# EAGLE design tlacitka (EAGLE 5.10)
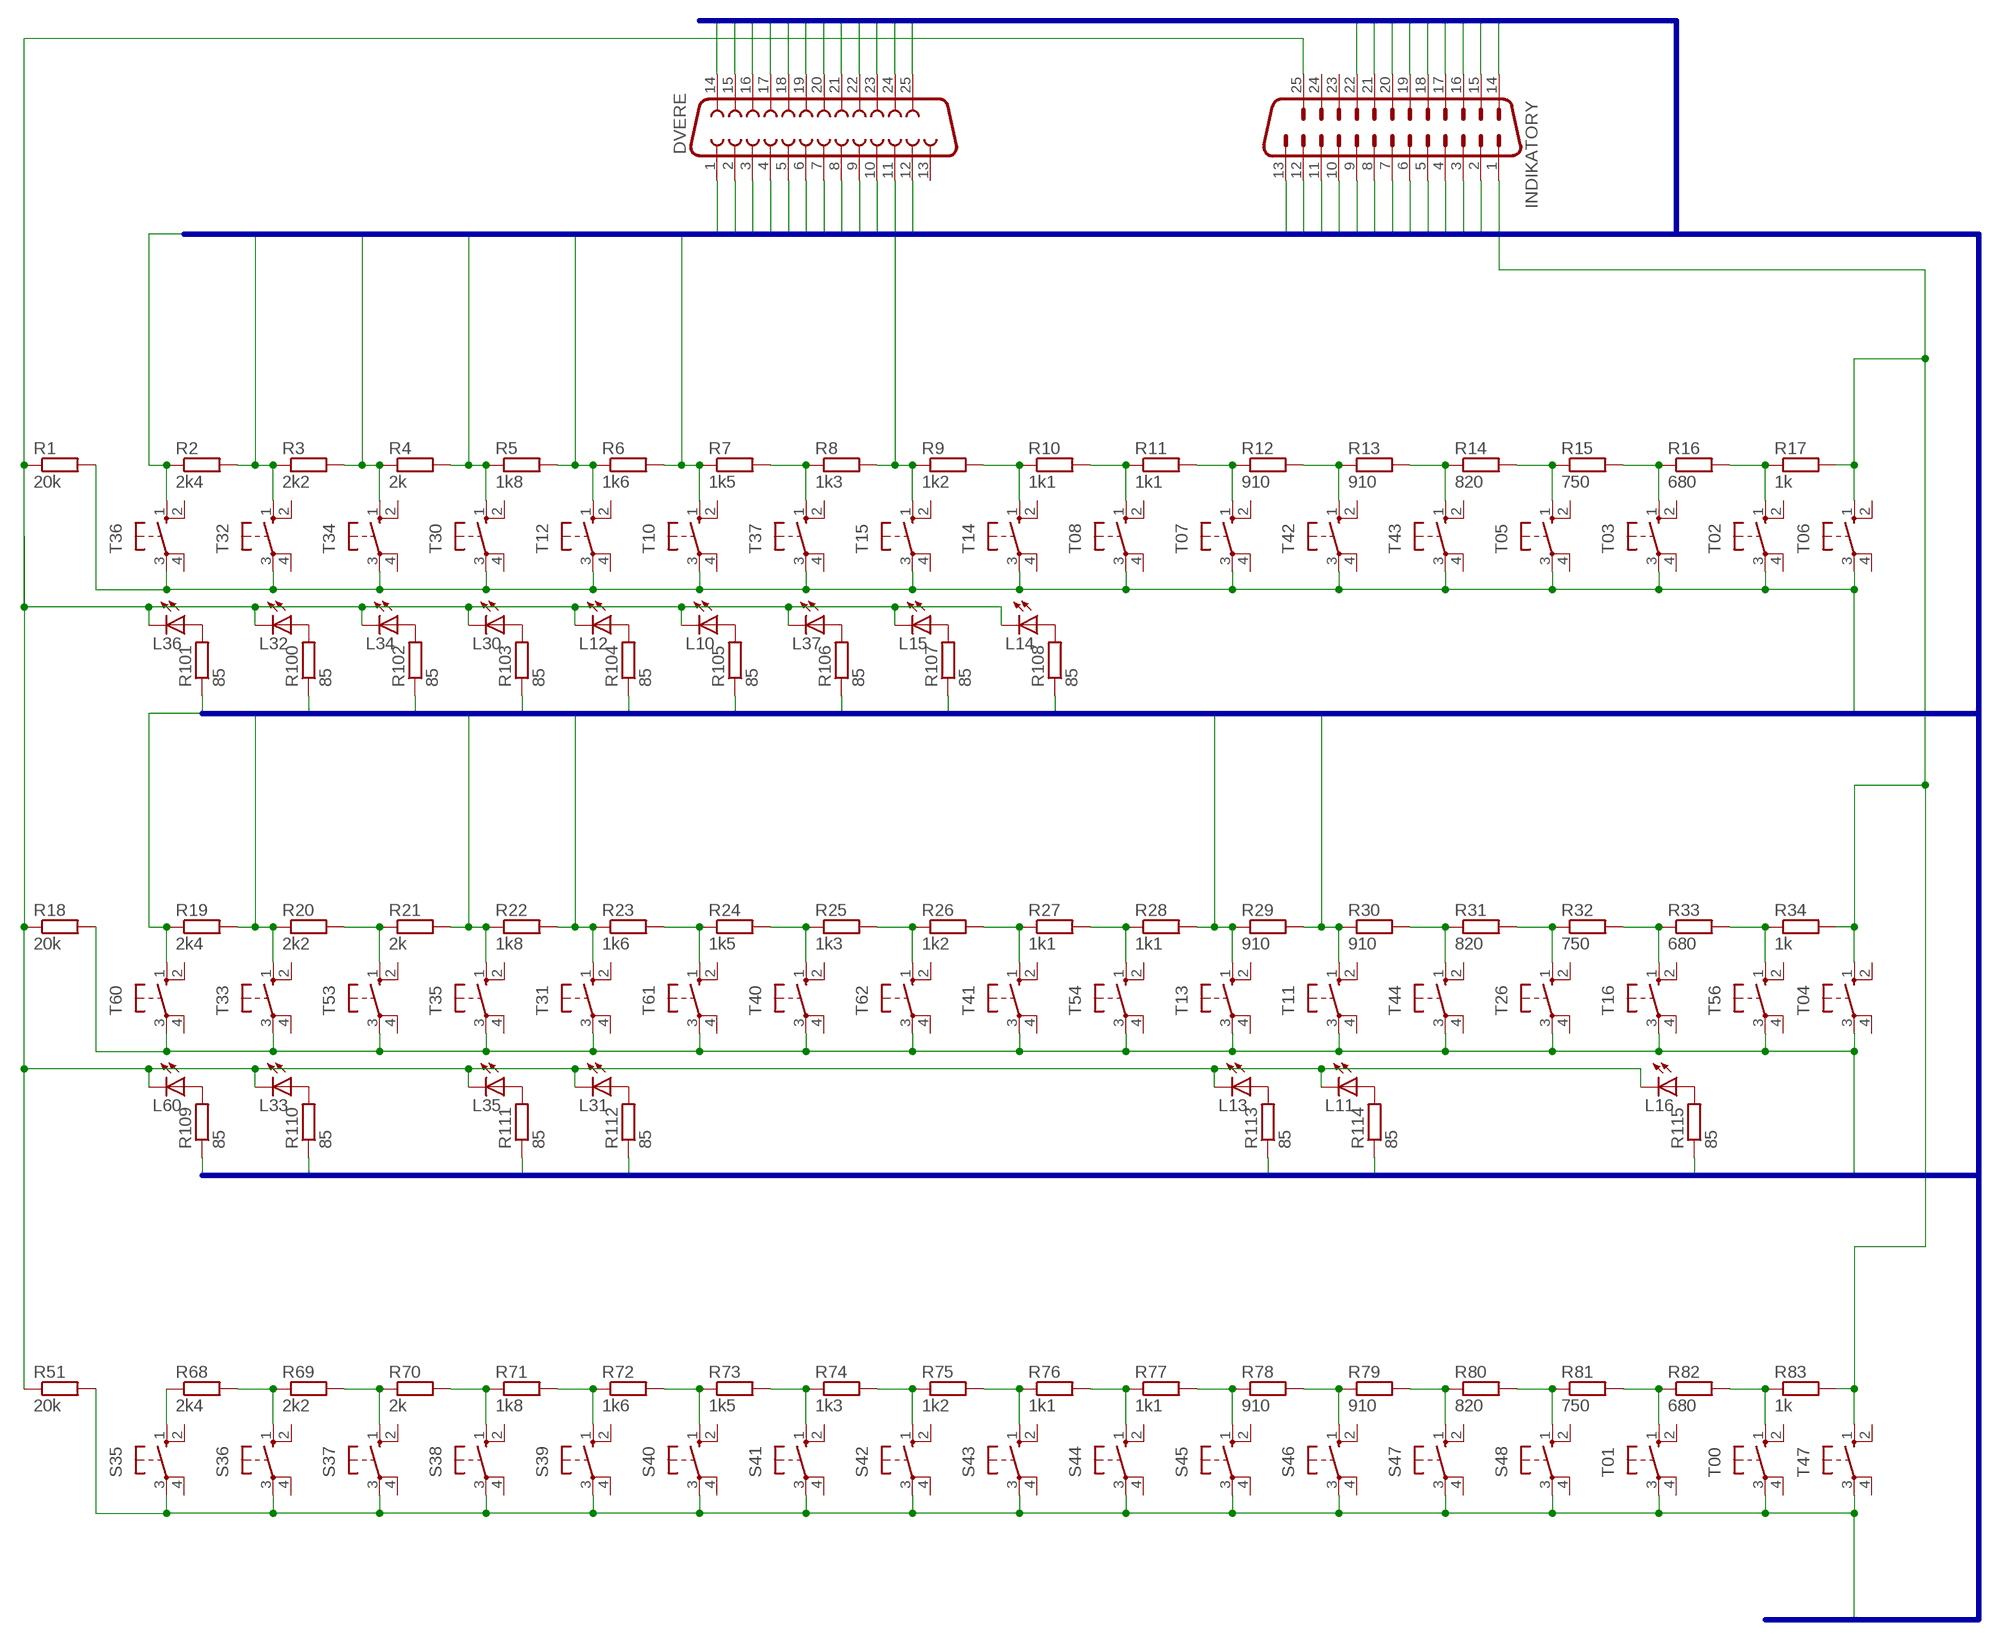
[diagram p0: schematic, sheet 1]

## Parts
DVERE  F25HP  [F25HP]
INDIKATORY  M25HP  [M25HP]
L10  LEDSMT1206  [1206]
L11  LEDSMT1206  [1206]
L12  LEDSMT1206  [1206]
L13  LEDSMT1206  [1206]
L14  LEDSMT1206  [1206]
L15  LEDSMT1206  [1206]
L16  LEDSMT1206  [1206]
L30  LEDSMT1206  [1206]
L31  LEDSMT1206  [1206]
L32  LEDSMT1206  [1206]
L33  LEDSMT1206  [1206]
L34  LEDSMT1206  [1206]
L35  LEDSMT1206  [1206]
L36  LEDSMT1206  [1206]
L37  LEDSMT1206  [1206]
L60  LEDSMT1206  [1206]
R1  20k  R-EU_0204/7  [0204/7]
R2  2k4  R-EU_0204/7  [0204/7]
R3  2k2  R-EU_0204/7  [0204/7]
R4  2k  R-EU_0204/7  [0204/7]
R5  1k8  R-EU_0204/7  [0204/7]
R6  1k6  R-EU_0204/7  [0204/7]
R7  1k5  R-EU_0204/7  [0204/7]
R8  1k3  R-EU_0204/7  [0204/7]
R9  1k2  R-EU_0204/7  [0204/7]
R10  1k1  R-EU_0204/7  [0204/7]
R11  1k1  R-EU_0204/7  [0204/7]
R12  910  R-EU_0204/7  [0204/7]
R13  910  R-EU_0204/7  [0204/7]
R14  820  R-EU_0204/7  [0204/7]
R15  750  R-EU_0204/7  [0204/7]
R16  680  R-EU_0204/7  [0204/7]
R17  1k  R-EU_0204/7  [0204/7]
R18  20k  R-EU_0204/7  [0204/7]
R19  2k4  R-EU_0204/7  [0204/7]
R20  2k2  R-EU_0204/7  [0204/7]
R21  2k  R-EU_0204/7  [0204/7]
R22  1k8  R-EU_0204/7  [0204/7]
R23  1k6  R-EU_0204/7  [0204/7]
R24  1k5  R-EU_0204/7  [0204/7]
R25  1k3  R-EU_0204/7  [0204/7]
R26  1k2  R-EU_0204/7  [0204/7]
R27  1k1  R-EU_0204/7  [0204/7]
R28  1k1  R-EU_0204/7  [0204/7]
R29  910  R-EU_0204/7  [0204/7]
R30  910  R-EU_0204/7  [0204/7]
R31  820  R-EU_0204/7  [0204/7]
R32  750  R-EU_0204/7  [0204/7]
R33  680  R-EU_0204/7  [0204/7]
R34  1k  R-EU_0204/7  [0204/7]
R51  20k  R-EU_0204/7  [0204/7]
R68  2k4  R-EU_0204/7  [0204/7]
R69  2k2  R-EU_0204/7  [0204/7]
R70  2k  R-EU_0204/7  [0204/7]
R71  1k8  R-EU_0204/7  [0204/7]
R72  1k6  R-EU_0204/7  [0204/7]
R73  1k5  R-EU_0204/7  [0204/7]
R74  1k3  R-EU_0204/7  [0204/7]
R75  1k2  R-EU_0204/7  [0204/7]
R76  1k1  R-EU_0204/7  [0204/7]
R77  1k1  R-EU_0204/7  [0204/7]
R78  910  R-EU_0204/7  [0204/7]
R79  910  R-EU_0204/7  [0204/7]
R80  820  R-EU_0204/7  [0204/7]
R81  750  R-EU_0204/7  [0204/7]
R82  680  R-EU_0204/7  [0204/7]
R83  1k  R-EU_0204/7  [0204/7]
R100  85  R-EU_R1206  [R1206]
R101  85  R-EU_R1206  [R1206]
R102  85  R-EU_R1206  [R1206]
R103  85  R-EU_R1206  [R1206]
R104  85  R-EU_R1206  [R1206]
R105  85  R-EU_R1206  [R1206]
R106  85  R-EU_R1206  [R1206]
R107  85  R-EU_R1206  [R1206]
R108  85  R-EU_R1206  [R1206]
R109  85  R-EU_R1206  [R1206]
R110  85  R-EU_R1206  [R1206]
R111  85  R-EU_R1206  [R1206]
R112  85  R-EU_R1206  [R1206]
R113  85  R-EU_R1206  [R1206]
R114  85  R-EU_R1206  [R1206]
R115  85  R-EU_R1206  [R1206]
S35  10-XX  [B3F-10XX]
S36  10-XX  [B3F-10XX]
S37  10-XX  [B3F-10XX]
S38  10-XX  [B3F-10XX]
S39  10-XX  [B3F-10XX]
S40  10-XX  [B3F-10XX]
S41  10-XX  [B3F-10XX]
S42  10-XX  [B3F-10XX]
S43  10-XX  [B3F-10XX]
S44  10-XX  [B3F-10XX]
S45  10-XX  [B3F-10XX]
S46  10-XX  [B3F-10XX]
S47  10-XX  [B3F-10XX]
S48  10-XX  [B3F-10XX]
T00  10-XX  [B3F-10XX]
T01  10-XX  [B3F-10XX]
T02  10-XX  [B3F-10XX]
T03  10-XX  [B3F-10XX]
T04  10-XX  [B3F-10XX]
T05  10-XX  [B3F-10XX]
T06  10-XX  [B3F-10XX]
T07  10-XX  [B3F-10XX]
T08  10-XX  [B3F-10XX]
T10  10-XX  [B3F-10XX]
T11  10-XX  [B3F-10XX]
T12  10-XX  [B3F-10XX]
T13  10-XX  [B3F-10XX]
T14  10-XX  [B3F-10XX]
T15  10-XX  [B3F-10XX]
T16  10-XX  [B3F-10XX]
T26  10-XX  [B3F-10XX]
T30  10-XX  [B3F-10XX]
T31  10-XX  [B3F-10XX]
T32  10-XX  [B3F-10XX]
T33  10-XX  [B3F-10XX]
T34  10-XX  [B3F-10XX]
T35  10-XX  [B3F-10XX]
T36  10-XX  [B3F-10XX]
T37  10-XX  [B3F-10XX]
T40  10-XX  [B3F-10XX]
T41  10-XX  [B3F-10XX]
T42  10-XX  [B3F-10XX]
T43  10-XX  [B3F-10XX]
T44  10-XX  [B3F-10XX]
T47  10-XX  [B3F-10XX]
T53  10-XX  [B3F-10XX]
T54  10-XX  [B3F-10XX]
T56  10-XX  [B3F-10XX]
T60  10-XX  [B3F-10XX]
T61  10-XX  [B3F-10XX]
T62  10-XX  [B3F-10XX]

## Nets
BDV1: DVERE.1 R6.2 R7.1 T10.1(S)
BDV2: DVERE.7 R29.2 R30.1 T11.1(S)
BDV3: DVERE.14 R5.2 R6.1 T12.1(S)
BDV4: DVERE.20 R28.2 R29.1 T13.1(S)
BKUFR: INDIKATORY.21 R8.2 R9.1 T15.1(S)
BO1D: DVERE.5 R3.2 R4.1 T34.1(S)
BO1U: DVERE.3 R4.2 R5.1 T30.1(S)
BO2D: DVERE.11 R21.2 R22.1 T35.1(S)
BO2U: DVERE.9 R22.2 R23.1 T31.1(S)
BO3D: DVERE.18 R2.1 T36.1(S)
BO3U: DVERE.16 R2.2 R3.1 T32.1(S)
BO4D: DVERE.24 R19.1 T60.1(S)
BO4U: DVERE.22 R19.2 R20.1 T33.1(S)
J10: INDIKATORY.5 R105.1
J11: INDIKATORY.6 R114.1
J12: INDIKATORY.7 R104.1
J13: INDIKATORY.8 R113.1
J14: INDIKATORY.17 R108.1
J15: INDIKATORY.19 R107.1
J16: INDIKATORY.18 R115.1
J30: INDIKATORY.9 R103.1
J31: INDIKATORY.10 R112.1
J32: INDIKATORY.11 R100.1
J33: INDIKATORY.12 R110.1
J34: INDIKATORY.13 R102.1
J35: INDIKATORY.14 R111.1
J36: INDIKATORY.15 R101.1
J37: INDIKATORY.20 R106.1
J60: INDIKATORY.16 R109.1
JB1: DVERE.2 DVERE.4 DVERE.6 DVERE.15 DVERE.17 DVERE.19 INDIKATORY.2 INDIKATORY.22 R1.2 T02.3(P) T03.3(P) T05.3(P) T06.3(P) T07.3(P) T08.3(P) T10.3(P) T12.3(P) T14.3(P) T15.3(P) T30.3(P) T32.3(P) T34.3(P) T36.3(P) T37.3(P) T42.3(P) T43.3(P)
JB2: DVERE.8 DVERE.10 DVERE.12 DVERE.21 DVERE.23 DVERE.25 INDIKATORY.3 R18.2 T04.3(P) T11.3(P) T13.3(P) T16.3(P) T26.3(P) T31.3(P) T33.3(P) T35.3(P) T40.3(P) T41.3(P) T44.3(P) T53.3(P) T54.3(P) T56.3(P) T60.3(P) T61.3(P) T62.3(P)
JB3: INDIKATORY.4 R51.2 S35.3(P) S36.3(P) S37.3(P) S38.3(P) S39.3(P) S40.3(P) S41.3(P) S42.3(P) S43.3(P) S44.3(P) S45.3(P) S46.3(P) S47.3(P) S48.3(P) T00.3(P) T01.3(P) T47.3(P)
N$1: INDIKATORY.1 R17.2 R34.2 R83.2 T04.1(S) T06.1(S) T47.1(S)
N$7: R7.2 R8.1 T37.1(S)
N$9: R9.2 R10.1 T14.1(S)
N$10: R10.2 R11.1 T08.1(S)
N$11: R11.2 R12.1 T07.1(S)
N$12: R12.2 R13.1 T42.1(S)
N$13: R13.2 R14.1 T43.1(S)
N$14: R14.2 R15.1 T05.1(S)
N$15: R15.2 R16.1 T03.1(S)
N$16: R16.2 R17.1 T02.1(S)
N$20: R20.2 R21.1 T53.1(S)
N$23: R23.2 R24.1 T61.1(S)
N$24: R24.2 R25.1 T40.1(S)
N$25: R25.2 R26.1 T62.1(S)
N$26: R26.2 R27.1 T41.1(S)
N$27: R27.2 R28.1 T54.1(S)
N$30: R30.2 R31.1 T44.1(S)
N$31: R31.2 R32.1 T26.1(S)
N$32: R32.2 R33.1 T16.1(S)
N$33: R33.2 R34.1 T56.1(S)
N$52: L10.A R105.2
N$53: R68.1 S35.1(S)
N$54: R68.2 R69.1 S36.1(S)
N$55: R69.2 R70.1 S37.1(S)
N$72: R70.2 R71.1 S38.1(S)
N$73: L12.A R104.2
N$74: L30.A R103.2
N$75: R71.2 R72.1 S39.1(S)
N$76: R72.2 R73.1 S40.1(S)
N$77: R73.2 R74.1 S41.1(S)
N$78: R74.2 R75.1 S42.1(S)
N$79: R75.2 R76.1 S43.1(S)
N$80: R76.2 R77.1 S44.1(S)
N$81: R77.2 R78.1 S45.1(S)
N$82: R78.2 R79.1 S46.1(S)
N$83: R79.2 R80.1 S47.1(S)
N$84: R80.2 R81.1 S48.1(S)
N$85: R81.2 R82.1 T01.1(S)
N$86: R82.2 R83.1 T00.1(S)
N$104: L34.A R102.2
N$106: L32.A R100.2
N$107: L36.A R101.2
N$108: L37.A R106.2
N$109: L15.A R107.2
N$110: L14.A R108.2
N$111: L60.A R109.2
N$112: L33.A R110.2
N$113: L35.A R111.2
N$114: L31.A R112.2
N$115: L13.A R113.2
N$116: L11.A R114.2
N$117: L16.A R115.2
N$119: INDIKATORY.25 L10.C L11.C L12.C L13.C L14.C L15.C L16.C L30.C L31.C L32.C L33.C L34.C L35.C L36.C L37.C L60.C R1.1 R18.1 R51.1
Unconnected: DVERE.13 INDIKATORY.23 INDIKATORY.24 S35.2(S1) S35.4(P1) S36.2(S1) S36.4(P1) S37.2(S1) S37.4(P1) S38.2(S1) S38.4(P1) S39.2(S1) S39.4(P1) S40.2(S1) S40.4(P1) S41.2(S1) S41.4(P1) S42.2(S1) S42.4(P1) S43.2(S1) S43.4(P1) S44.2(S1) S44.4(P1) S45.2(S1) S45.4(P1) S46.2(S1) S46.4(P1) S47.2(S1) S47.4(P1) S48.2(S1) S48.4(P1) T00.2(S1) T00.4(P1) T01.2(S1) T01.4(P1) T02.2(S1) T02.4(P1) T03.2(S1) T03.4(P1) T04.2(S1) T04.4(P1) T05.2(S1) T05.4(P1) T06.2(S1) T06.4(P1) T07.2(S1) T07.4(P1) T08.2(S1) T08.4(P1) T10.2(S1) T10.4(P1) T11.2(S1) T11.4(P1) T12.2(S1) T12.4(P1) T13.2(S1) T13.4(P1) T14.2(S1) T14.4(P1) T15.2(S1) T15.4(P1) T16.2(S1) T16.4(P1) T26.2(S1) T26.4(P1) T30.2(S1) T30.4(P1) T31.2(S1) T31.4(P1) T32.2(S1) T32.4(P1) T33.2(S1) T33.4(P1) T34.2(S1) T34.4(P1) T35.2(S1) T35.4(P1) T36.2(S1) T36.4(P1) T37.2(S1) T37.4(P1) T40.2(S1) T40.4(P1) T41.2(S1) T41.4(P1) T42.2(S1) T42.4(P1) T43.2(S1) T43.4(P1) T44.2(S1) T44.4(P1) T47.2(S1) T47.4(P1) T53.2(S1) T53.4(P1) T54.2(S1) T54.4(P1) T56.2(S1) T56.4(P1) T60.2(S1) T60.4(P1) T61.2(S1) T61.4(P1) T62.2(S1) T62.4(P1)

## Buses
B$1

## Library data of the parts
DVERE = con-subd:F25: SUB-D
INDIKATORY = con-subd:M25: SUB-D
L10-L16 L30-L37 L60 = led:LED: LED OSRAM: - CHIPLED LG R971, LG N971, LY N971, LG Q971, LY Q971, LO R971, LY R971 LH N974, LH R974 LS Q976, LO Q976, LY Q976 LO Q996 - Hyper CHIPLED LW Q18S LB Q993, LB Q99A, LB R99A - SideLED LS A670, LO A670, LY A670, LG A670, LP A670 LB A673, LV A673, LT A673, LW A673 LH A674 LY A675 LS A676, LA A676, LO A676, LY A676, LW A676 LS A679, LY A679, LG A679 - Hyper Micro SIDELED® LS Y876, LA Y876, LO Y876, LY Y876 LT Y87S - SmartLED LW L88C, LW L88S LB L89C, LB L89S, LG L890 LS L89K, LO L89K, LY L89K LS L896, LA L896, LO L896, LY L896 - TOPLED LS T670, LO T670, LY T670, LG T670, LP T670 LSG T670, LSP T670, LSY T670, LOP T670, LYG T670 LG T671, LOG T671, LSG T671 LB T673, LV T673, LT T673, LW T673 LH T674 LS T676, LA T676, LO T676, LY T676, LB T676, LH T676, LSB T676, LW T676 LB T67C, LV T67C, LT T67C, LS T67K, LO T67K, LY T67K, LW E67C LS E67B, LA E67B, LO E67B, LY E67B, LB E67C, LV E67C, LT E67C LW T67C LS T679, LY T679, LG T679 LS T770, LO T770, LY T770, LG T770, LP T770 LB T773, LV T773, LT T773, LW T773 LH T774 LS E675, LA E675, LY E675, LS T675 LS T776, LA T776, LO T776, LY T776, LB T776 LHGB T686 LT T68C, LB T68C - Hyper Mini TOPLED® LB M676 - Mini TOPLED Santana® LG M470 LS M47K, LO M47K, LY M47K Source: http://www.osram.convergy.de LUXEON: - LUMILED® LXK2-PW12-R00, LXK2-PW12-S00, LXK2-PW14-U00, LXK2-PW14-V00 LXK2-PM12-R00, LXK2-PM12-S00, LXK2-PM14-U00 LXK2-PE12-Q00, LXK2-PE12-R00, LXK2-PE12-S00, LXK2-PE14-T00, LXK2-PE14-U00 LXK2-PB12-K00, LXK2-PB12-L00, LXK2-PB12-M00, LXK2-PB14-N00, LXK2-PB14-P00, LXK2-PB14-Q00 LXK2-PR12-L00, LXK2-PR12-M00, LXK2-PR14-Q00, LXK2-PR14-R00 LXK2-PD12-Q00, LXK2-PD12-R00, LXK2-PD12-S00 LXK2-PH12-R00, LXK2-PH12-S00 LXK2-PL12-P00, LXK2-PL12-Q00, LXK2-PL12-R00 Source: www.luxeon.com KINGBRIGHT: KA-3528ASYC Source: www.kingbright.com
R1-R34 R51 R68-R83 R100-R115 = resistor:R-EU_: RESISTOR, European symbol
S35-S48 T00 T01-T08 T10-T16 T26 T30-T37 T40-T44 T47 T53 T54 T56 T60-T62 = switch-omron:10-XX: OMRON SWITCH

## Board
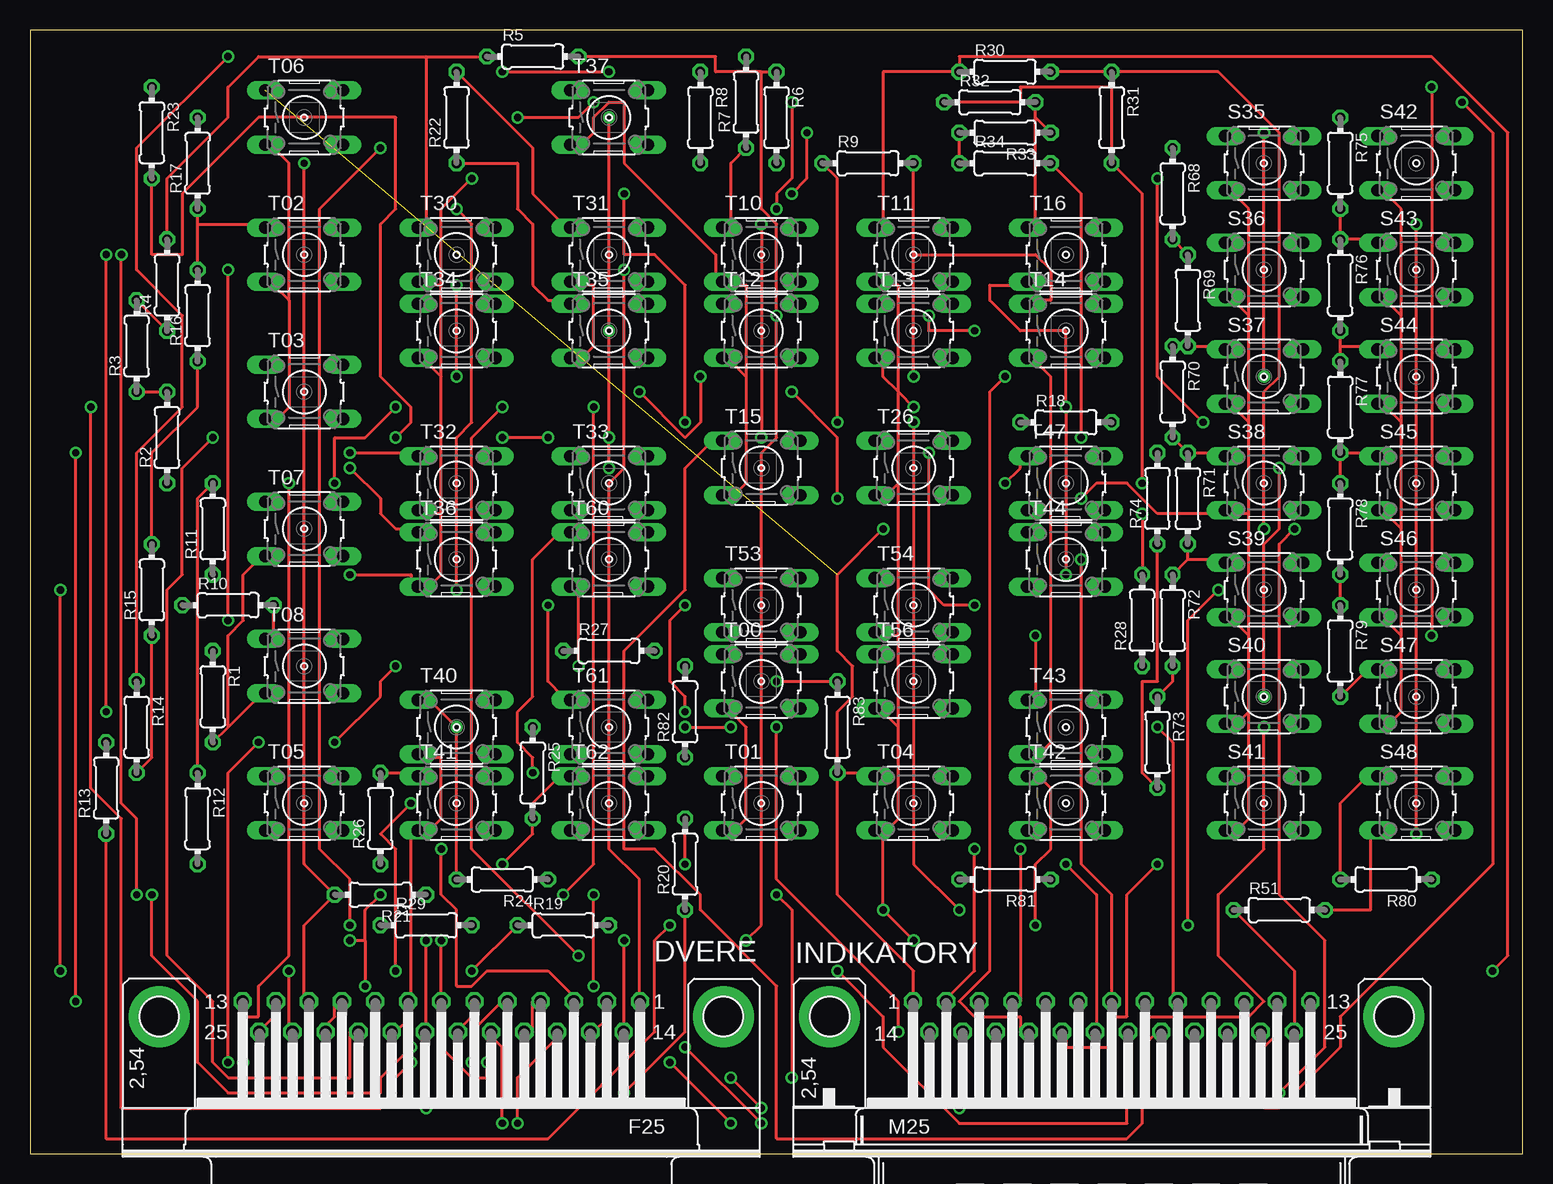
[diagram p1: board, top side]
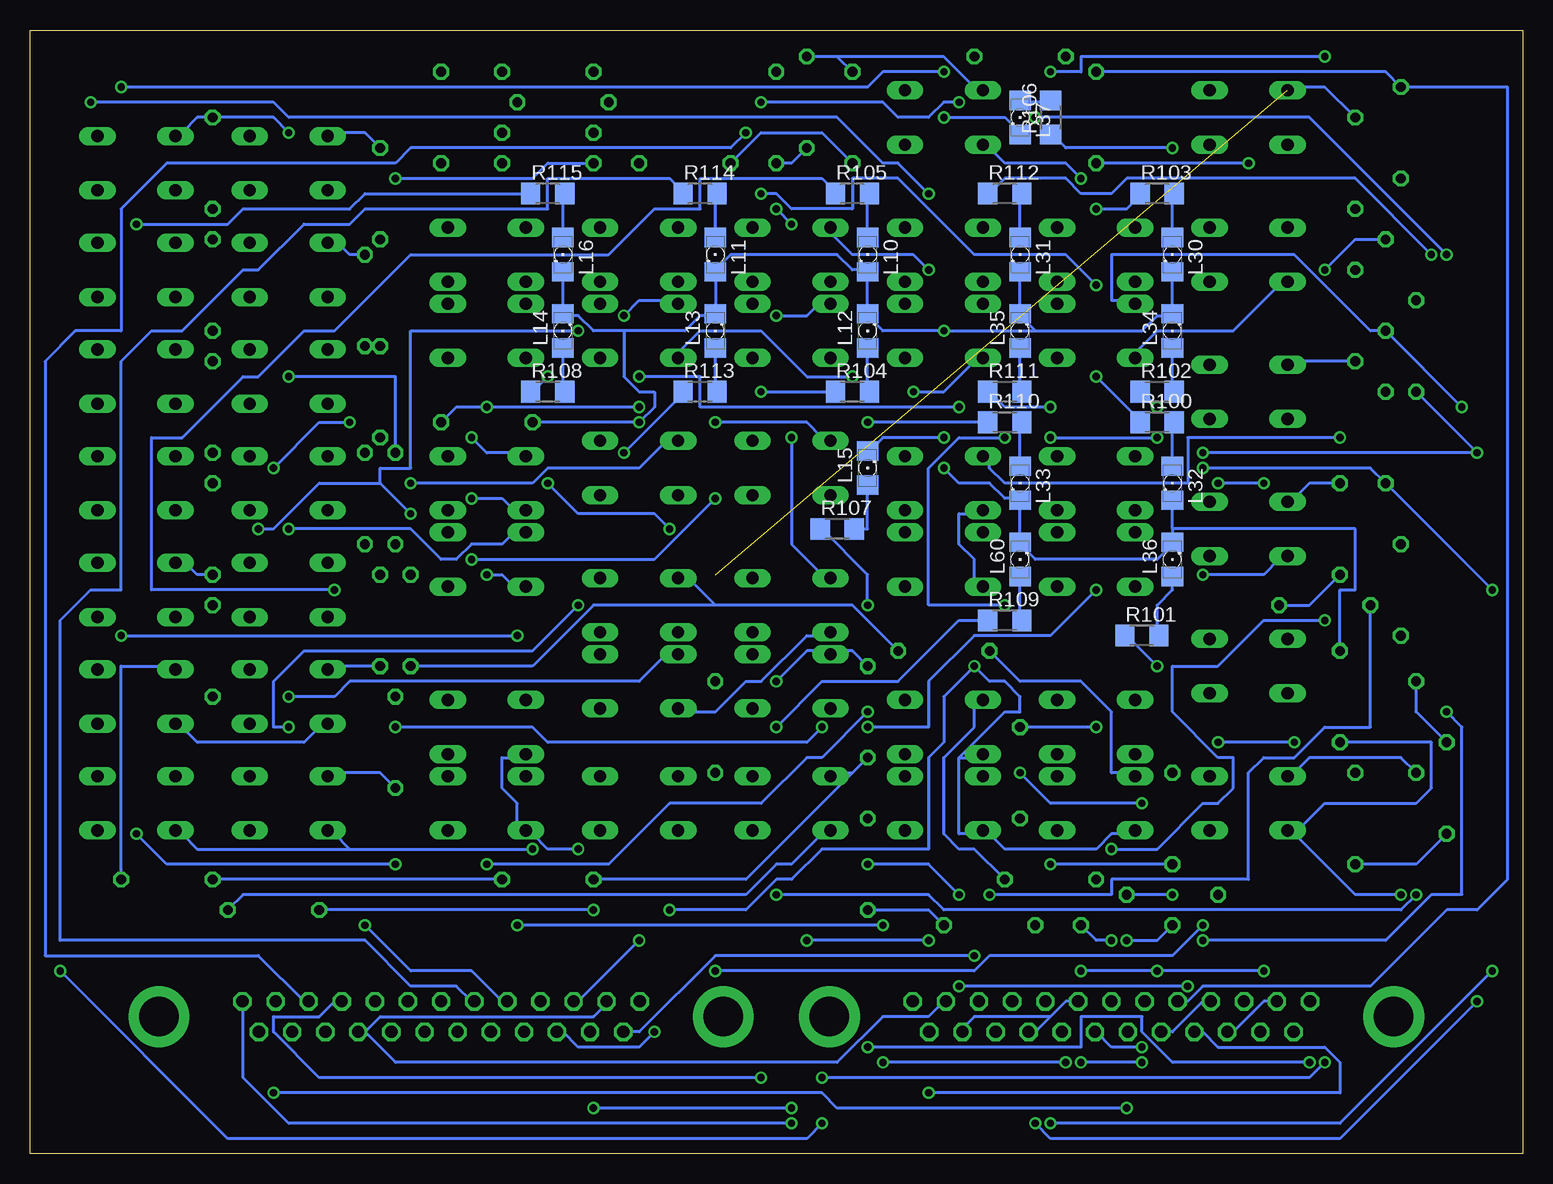
[diagram p2: board, bottom side, seen from below]

Size 124.44 x 93.65 mm. Coordinates in mm from the lower left corner, seen from the top.
Outline: 0,0 124.44,0 124.44,93.65 0,93.65 0,0
Copper layers (1*16): Top 0.035mm / dielectric 1.5mm / Bottom 0.035mm
Design rules "default": minimum track width 10mil, minimum drill 24mil, track to track 8mil, track to pad 8mil, pad to pad 8mil, via to via 8mil, smd to smd 8mil, copper to edge 40mil, drill to drill 8mil, minimum pad ring 10mil, minimum via ring 8mil, stop-mask expansion 4mil, vias tented up to drill 0mil, thermal gap 10mil

### Footprints (pad centres in the part's own frame; a part is rotated, then mirrored left to right if it is on the bottom)
F25HP = drill 1.016 octagon: 1 -16.561,-1.27; 2 -13.792,-1.27; 3 -11.049,-1.27; 4 -8.28,-1.27; 5 -5.512,-1.27; 6 -2.769,-1.27; 7 0,-1.27; 8 2.769,-1.27; 9 5.512,-1.27; 10 8.28,-1.27; 11 11.049,-1.27; 12 13.792,-1.27; 13 16.561,-1.27; 14 -15.189,1.27; 15 -12.421,1.27; 16 -9.652,1.27; 17 -6.909,1.27; 18 -4.14,1.27; 19 -1.372,1.27; 20 1.372,1.27; 21 4.14,1.27; 22 6.909,1.27; 23 9.652,1.27; 24 12.421,1.27; 25 15.189,1.27 | drill 3.302 pad 5.08 round: G1 -23.52,0; G2 23.52,0
M25HP = drill 1.016 octagon: 1 -16.561,1.27; 2 -13.792,1.27; 3 -11.049,1.27; 4 -8.28,1.27; 5 -5.512,1.27; 6 -2.769,1.27; 7 0,1.27; 8 2.769,1.27; 9 5.512,1.27; 10 8.28,1.27; 11 11.049,1.27; 12 13.792,1.27; 13 16.561,1.27; 14 -15.189,-1.27; 15 -12.421,-1.27; 16 -9.652,-1.27; 17 -6.909,-1.27; 18 -4.14,-1.27; 19 -1.372,-1.27; 20 1.372,-1.27; 21 4.14,-1.27; 22 6.909,-1.27; 23 9.652,-1.27; 24 12.421,-1.27; 25 15.189,-1.27 | drill 3.302 pad 5.08 round: G1 -23.52,0; G2 23.52,0
1206 = smd 1.6 x 1.803: A -1.422,0; C 1.422,0
0204/7 = drill 0.813 octagon: 1 -3.81,0; 2 3.81,0
R1206 = smd 1.6 x 1.803: 1 -1.422,0; 2 1.422,0
B3F-10XX = drill 1.016 long: 1 -3.251,2.261; 2 3.251,2.261; 3 -3.251,-2.261; 4 3.251,-2.261

### Placement (x,y rotation side)
DVERE  34.29,11.43 180 top
INDIKATORY  90.17,11.43 0 top
L10  54.61,74.93 270 bottom
L11  67.31,74.93 270 bottom
L12  54.61,68.58 90 bottom
L13  67.31,68.58 90 bottom
L14  80.01,68.58 90 bottom
L15  54.61,57.15 90 bottom
L16  80.01,74.93 270 bottom
L30  29.21,74.93 270 bottom
L31  41.91,74.93 270 bottom
L32  29.21,55.88 270 bottom
L33  41.91,55.88 270 bottom
L34  29.21,68.58 90 bottom
L35  41.91,68.58 90 bottom
L36  29.21,49.53 90 bottom
L37  41.91,86.36 270 bottom
L60  41.91,49.53 90 bottom
R1  15.24,38.1 270 top
R2  11.43,59.69 90 top
R3  8.89,67.31 90 top
R4  11.43,72.39 90 top
R5  41.91,91.44 0 top
R6  62.23,86.36 270 top
R7  59.69,87.63 90 top
R8  55.88,86.36 270 top
R9  69.85,82.55 0 top
R10  16.51,45.72 0 top
R11  15.24,52.07 90 top
R12  13.97,27.94 270 top
R13  6.35,30.48 90 top
R14  8.89,35.56 270 top
R15  10.16,46.99 90 top
R16  13.97,69.85 90 top
R17  13.97,82.55 90 top
R18  86.36,60.96 0 top
R19  44.45,19.05 0 top
R20  54.61,24.13 90 top
R21  29.21,21.59 180 top
R22  35.56,86.36 90 top
R23  10.16,85.09 270 top
R24  39.37,22.86 180 top
R25  41.91,31.75 270 top
R26  29.21,27.94 90 top
R27  48.26,41.91 0 top
R28  92.71,44.45 90 top
R29  33.02,19.05 0 top
R30  81.28,90.17 0 top
R31  90.17,86.36 270 top
R32  80.01,87.63 0 top
R33  81.28,85.09 180 top
R34  81.28,82.55 0 top
R51  104.14,20.32 0 top
R68  95.25,80.01 270 top
R69  96.52,71.12 270 top
R70  95.25,63.5 270 top
R71  96.52,54.61 270 top
R72  95.25,44.45 270 top
R73  93.98,34.29 270 top
R74  93.98,54.61 90 top
R75  109.22,82.55 270 top
R76  109.22,72.39 270 top
R77  109.22,62.23 270 top
R78  109.22,52.07 270 top
R79  109.22,41.91 270 top
R80  113.03,22.86 180 top
R81  81.28,22.86 180 top
R82  54.61,36.83 90 top
R83  67.31,35.56 270 top
R100  30.48,60.96 0 bottom
R101  31.75,43.18 0 bottom
R102  30.48,63.5 0 bottom
R103  30.48,80.01 0 bottom
R104  55.88,63.5 0 bottom
R105  55.88,80.01 0 bottom
R106  39.37,86.36 90 bottom
R107  57.15,52.07 0 bottom
R108  81.28,63.5 0 bottom
R109  43.18,44.45 0 bottom
R110  43.18,60.96 0 bottom
R111  43.18,63.5 0 bottom
R112  43.18,80.01 0 bottom
R113  68.58,63.5 0 bottom
R114  68.58,80.01 0 bottom
R115  81.28,80.01 0 bottom
S35  102.87,82.55 0 top
S36  102.87,73.66 0 top
S37  102.87,64.77 0 top
S38  102.87,55.88 0 top
S39  102.87,46.99 0 top
S40  102.87,38.1 0 top
S41  102.87,29.21 0 top
S42  115.57,82.55 0 top
S43  115.57,73.66 0 top
S44  115.57,64.77 0 top
S45  115.57,55.88 0 top
S46  115.57,46.99 0 top
S47  115.57,38.1 0 top
S48  115.57,29.21 0 top
T00  60.96,39.37 0 top
T01  60.96,29.21 0 top
T02  22.86,74.93 0 top
T03  22.86,63.5 0 top
T04  73.66,29.21 0 top
T05  22.86,29.21 0 top
T06  22.86,86.36 0 top
T07  22.86,52.07 0 top
T08  22.86,40.64 0 top
T10  60.96,74.93 0 top
T11  73.66,74.93 0 top
T12  60.96,68.58 0 top
T13  73.66,68.58 0 top
T14  86.36,68.58 0 top
T15  60.96,57.15 0 top
T16  86.36,74.93 0 top
T26  73.66,57.15 0 top
T30  35.56,74.93 0 top
T31  48.26,74.93 0 top
T32  35.56,55.88 0 top
T33  48.26,55.88 0 top
T34  35.56,68.58 0 top
T35  48.26,68.58 0 top
T36  35.56,49.53 0 top
T37  48.26,86.36 0 top
T40  35.56,35.56 0 top
T41  35.56,29.21 0 top
T42  86.36,29.21 0 top
T43  86.36,35.56 0 top
T44  86.36,49.53 0 top
T47  86.36,55.88 0 top
T53  60.96,45.72 0 top
T54  73.66,45.72 0 top
T56  73.66,39.37 0 top
T60  48.26,49.53 0 top
T61  48.26,35.56 0 top
T62  48.26,29.21 0 top

### Tracks (layer width: path | path; a pad name or v marks a point on that pad's centre or on a via)
BDV1  (via drill 0.61)
  Top 0.254: v49.53,73.66 49.53,57.15 48.26,55.88 48.26,25.4 50.8,22.86 50.8,12.7 DVERE.1 | R7.1 58.42,82.55 58.42,77.47 T10.1
  Bottom 0.254: R7.1 60.96,82.55 R6.2 | v49.53,73.66 50.8,74.93 55.88,74.93 58.42,77.47 T10.1
BDV2  (via drill 0.61)
  Top 0.254: v34.29,17.78 DVERE.7 34.29,8.89 36.83,6.35 38.1,6.35 v38.1,7.62 | T11.1 71.12,77.47 71.12,90.17 R30.1 77.47,91.44 116.84,91.44 123.19,85.09 123.19,16.51 v121.92,15.24 | v53.34,7.62 v58.42,2.54
  Bottom 0.254: R29.2 35.56,17.78 v34.29,17.78 | v38.1,7.62 v53.34,7.62 | v58.42,2.54 59.69,1.27 107.95,1.27 v121.92,15.24
BDV3  (via drill 0.61)
  Top 0.254: 60.96,90.17 57.15,90.17 57.15,91.44 R5.2 | 60.96,90.17 R6.1 | v49.53,17.78 49.53,10.16 DVERE.14 | v59.69,17.78 60.96,19.05 60.96,58.42 62.23,59.69 v62.23,69.85 62.23,77.47 60.96,78.74 60.96,90.17
  Bottom 0.254: v49.53,17.78 v59.69,17.78 | v62.23,69.85 59.69,69.85 58.42,71.12 T12.1
BDV4  (via drill 0.61)
  Top 0.254: 33.02,10.16 v33.02,17.78 | v92.71,53.34 R28.2 | v78.74,68.58 74.93,68.58 v74.93,69.85 | v33.02,3.81 33.02,10.16 | v104.14,5.08 107.95,8.89 107.95,17.78 104.14,21.59 104.14,50.8 v105.41,52.07 | 33.02,10.16 DVERE.20
  Bottom 0.254: R29.1 30.48,17.78 v33.02,17.78 | 95.25,55.88 v92.71,53.34 | 95.25,55.88 95.25,57.15 92.71,57.15 92.71,68.58 v78.74,68.58 | v74.93,69.85 73.66,71.12 71.12,71.12 T13.1 | v33.02,3.81 57.15,3.81 58.42,5.08 v104.14,5.08 | v105.41,52.07 104.14,52.07 100.33,55.88 95.25,55.88
BKUFR  (via drill 0.61)
  Top 0.254: v67.31,60.96 67.31,81.28 R9.1 | INDIKATORY.21 93.98,10.16 92.71,8.89 92.71,2.54 91.44,1.27 62.23,1.27 62.23,13.97 55.88,20.32 55.88,21.59 52.07,25.4 49.53,25.4 49.53,41.91 54.61,46.99 54.61,57.15 57.15,59.69 T15.1
  Bottom 0.254: R8.2 58.42,85.09 63.5,85.09 R9.1 | v67.31,60.96 59.69,60.96 58.42,59.69 T15.1
BO1D  (via drill 0.61)
  Top 0.254: R4.1 R3.2 | v36.83,7.62 36.83,10.16 39.37,12.7 DVERE.5 | v31.75,7.62 30.48,6.35 30.48,5.08 29.21,3.81 7.62,3.81 7.62,27.94 5.08,30.48 v5.08,62.23
  Bottom 0.254: T34.1 33.02,71.12 34.29,71.12 34.29,74.93 19.05,74.93 12.7,68.58 R4.1 v5.08,62.23 | v31.75,7.62 v36.83,7.62
BO1U  (via drill 0.61)
  Top 0.254: R4.2 11.43,81.28 16.51,86.36 16.51,88.9 19.05,91.44 33.02,91.44 | 33.02,91.44 R5.1 | v34.29,25.4 34.29,21.59 35.56,20.32 35.56,13.97 36.83,13.97 38.1,15.24 43.18,15.24 45.72,12.7 DVERE.3 | v16.51,44.45 v16.51,73.66 | 33.02,91.44 33.02,77.47 T30.1
  Bottom 0.254: v34.29,25.4 30.48,25.4 26.67,29.21 25.4,29.21 24.13,30.48 24.13,33.02 25.4,33.02 29.21,36.83 29.21,40.64 25.4,40.64 21.59,44.45 v16.51,44.45 | v16.51,73.66 13.97,76.2 R4.2
BO2D  (via drill 0.61)
  Top 0.254: DVERE.11 22.86,12.7 22.86,19.05 R21.2 22.86,24.13 v22.86,82.55 | R22.1 40.64,82.55 40.64,78.74 41.91,77.47 41.91,72.39 43.18,71.12 44.45,71.12 T35.1
  Bottom 0.254: v22.86,82.55 R22.1
BO2U
  Top 0.254: R22.2 41.91,83.82 41.91,80.01 44.45,77.47 T31.1
  Bottom 0.254: R22.2 11.43,90.17 R23.1 1.27,88.9 1.27,22.86 3.81,20.32 6.35,20.32 12.7,13.97 26.67,13.97 27.94,12.7 DVERE.9 29.21,12.7
BO3D  (via drill 0.61)
  Top 0.254: v26.67,57.15 29.21,54.61 29.21,53.34 30.48,52.07 31.75,52.07 T36.1 | v39.37,2.54 39.37,8.89 38.1,10.16 DVERE.18 | v2.54,15.24 v2.54,46.99
  Bottom 0.254: v26.67,57.15 12.7,57.15 R2.1 v2.54,46.99 | v39.37,2.54 15.24,2.54 v2.54,15.24
BO3U  (via drill 0.61)
  Top 0.254: R3.1 R2.2 | v40.64,2.54 40.64,6.35 44.45,10.16 DVERE.16 | v3.81,12.7 v3.81,58.42 | v26.67,58.42 31.75,58.42 T32.1
  Bottom 0.254: v40.64,2.54 39.37,1.27 15.24,1.27 v3.81,12.7 | R3.1 v3.81,58.42 v26.67,58.42
BO4D  (via drill 0.61)
  Top 0.254: v36.83,15.24 R19.1 | v21.59,15.24 21.59,10.16 DVERE.24 | v41.91,31.75 41.91,33.02 40.64,34.29 40.64,36.83 41.91,38.1 41.91,49.53 44.45,52.07 T60.1 | v31.75,29.21 29.21,26.67 30.48,25.4 v30.48,15.24
  Bottom 0.254: v21.59,15.24 v30.48,15.24 v36.83,15.24 | v41.91,31.75 39.37,29.21 v31.75,29.21
BO4U  (via drill 0.61)
  Top 0.254: v49.53,5.08 54.61,10.16 R20.1 | v15.24,59.69 12.7,57.15 12.7,48.26 11.43,46.99 11.43,16.51 15.24,12.7 15.24,7.62 16.51,6.35 26.67,6.35 26.67,10.16 DVERE.22
  Bottom 0.254: R19.2 49.53,20.32 R20.1 | v49.53,5.08 15.24,5.08 15.24,7.62 16.51,8.89 25.4,8.89 26.67,10.16 DVERE.22 | v15.24,59.69 27.94,59.69 27.94,55.88 43.18,55.88 44.45,57.15 44.45,58.42 T33.1
J10  (via drill 0.61)
  Top 0.254: v99.06,46.99 96.52,44.45 v96.52,19.05
  Bottom 0.254: v99.06,46.99 114.3,46.99 114.3,59.69 111.76,59.69 106.68,64.77 105.41,64.77 101.6,68.58 99.06,68.58 92.71,74.93 76.2,74.93 72.39,78.74 68.58,78.74 68.58,81.28 58.42,81.28 57.15,80.01 R105.1 | v96.52,19.05 92.71,15.24 87.63,15.24 85.09,12.7 INDIKATORY.5
J11
  Bottom 0.254: R114.1 69.85,80.01 71.12,81.28 81.28,81.28 81.28,78.74 96.52,78.74 97.79,77.47 101.6,77.47 105.41,73.66 106.68,73.66 111.76,68.58 114.3,68.58 116.84,66.04 116.84,46.99 119.38,46.99 121.92,44.45 121.92,17.78 96.52,17.78 92.71,13.97 88.9,13.97 87.63,12.7 INDIKATORY.6
J12  (via drill 0.61)
  Top 0.254: v63.5,63.5 67.31,59.69 v67.31,54.61 | v87.63,49.53 87.63,24.13 90.17,21.59 INDIKATORY.7
  Bottom 0.254: v63.5,63.5 R104.1 57.15,63.5 | v67.31,54.61 72.39,49.53 v87.63,49.53
J13  (via drill 0.61)
  Top 0.254: v74.93,58.42 74.93,46.99 76.2,45.72 v78.74,45.72 | v102.87,35.56 102.87,25.4 99.06,21.59 99.06,16.51 102.87,12.7 101.6,11.43 92.71,11.43 92.71,12.7 INDIKATORY.8
  Bottom 0.254: v74.93,58.42 69.85,63.5 R113.1 | v78.74,45.72 82.55,41.91 101.6,41.91 104.14,39.37 104.14,35.56 v102.87,35.56
J14  (via drill 0.61)
  Top 0.254: v81.28,64.77 80.01,63.5 80.01,15.24 77.47,12.7 78.74,11.43 82.55,11.43 82.55,10.16 INDIKATORY.17
  Bottom 0.254: v81.28,64.77 82.55,63.5 R108.1
J15  (via drill 0.61)
  Top 0.254: v54.61,45.72 53.34,44.45 53.34,39.37 54.61,38.1 v54.61,36.83 | v86.36,24.13 88.9,21.59 88.9,10.16 INDIKATORY.19
  Bottom 0.254: v54.61,45.72 54.61,48.26 58.42,52.07 R107.1 | v54.61,36.83 58.42,33.02 59.69,33.02 63.5,29.21 71.12,29.21 76.2,24.13 v86.36,24.13
J16  (via drill 0.61)
  Top 0.254: v115.57,26.67 v115.57,77.47 | v93.98,24.13 91.44,21.59 91.44,11.43 90.17,11.43 90.17,8.89 86.36,8.89 86.36,10.16 INDIKATORY.18
  Bottom 0.254: v115.57,77.47 107.95,77.47 106.68,78.74 97.79,78.74 96.52,80.01 R115.1 82.55,80.01 | v115.57,26.67 113.03,24.13 v93.98,24.13
J30  (via drill 0.61)
  Top 0.254: v35.56,78.74 36.83,77.47 36.83,60.96 35.56,59.69 v35.56,46.99 | v54.61,35.56 v58.42,35.56 | v93.98,35.56 95.25,34.29 95.25,12.7 INDIKATORY.9
  Bottom 0.254: v35.56,78.74 33.02,78.74 31.75,80.01 R103.1 | v35.56,46.99 39.37,43.18 45.72,43.18 49.53,39.37 49.53,35.56 v54.61,35.56 | v58.42,35.56 59.69,34.29 81.28,34.29 82.55,35.56 v93.98,35.56
J31  (via drill 0.61)
  Top 0.254: v7.62,74.93 7.62,29.21 8.89,27.94 v8.89,21.59 | v62.23,21.59 63.5,20.32 v63.5,6.35
  Bottom 0.254: v7.62,74.93 13.97,81.28 33.02,81.28 34.29,80.01 36.83,80.01 38.1,81.28 43.18,81.28 44.45,80.01 R112.1 | v8.89,21.59 10.16,20.32 48.26,20.32 49.53,21.59 v62.23,21.59 | v63.5,6.35 100.33,6.35 104.14,10.16 104.14,11.43 100.33,11.43 99.06,12.7 INDIKATORY.10
J32  (via drill 0.61)
  Top 0.254: v35.56,64.77 v35.56,72.39 | v63.5,80.01 64.77,81.28 v64.77,85.09
  Bottom 0.254: v35.56,64.77 31.75,60.96 R100.1 | v35.56,72.39 38.1,74.93 45.72,74.93 52.07,81.28 55.88,81.28 55.88,78.74 60.96,78.74 62.23,80.01 v63.5,80.01 | v64.77,85.09 66.04,83.82 92.71,83.82 93.98,82.55 113.03,82.55 116.84,78.74 116.84,68.58 120.65,68.58 123.19,66.04 123.19,16.51 105.41,16.51 101.6,12.7 INDIKATORY.11
J33  (via drill 0.61)
  Top 0.254: v54.61,60.96 54.61,72.39 52.07,74.93 49.53,74.93 v49.53,80.01 | v119.38,87.63 121.92,85.09 121.92,24.13 109.22,11.43 109.22,8.89 104.14,3.81 102.87,3.81 102.87,8.89 104.14,10.16 104.14,12.7 INDIKATORY.12
  Bottom 0.254: v54.61,60.96 R110.1 44.45,60.96 | v49.53,80.01 52.07,82.55 53.34,82.55 57.15,86.36 102.87,86.36 104.14,87.63 v119.38,87.63
J34  (via drill 0.61)
  Top 0.254: v30.48,62.23 27.94,59.69 25.4,59.69 v25.4,55.88 | v21.59,55.88 21.59,16.51 19.05,13.97 19.05,11.43 17.78,11.43 v17.78,7.62 | v54.61,8.89 v60.96,2.54
  Bottom 0.254: v30.48,62.23 31.75,63.5 R102.1 | v21.59,55.88 v25.4,55.88 | v17.78,7.62 29.21,7.62 31.75,10.16 31.75,11.43 36.83,11.43 36.83,8.89 v54.61,8.89 | v60.96,2.54 102.87,2.54 106.68,6.35 106.68,12.7 INDIKATORY.13
J35  (via drill 0.61)
  Top 0.254: v39.37,62.23 36.83,59.69 36.83,25.4 v45.72,16.51
  Bottom 0.254: v39.37,62.23 43.18,62.23 44.45,63.5 R111.1 | v45.72,16.51 67.31,16.51 73.66,10.16 INDIKATORY.14
J36  (via drill 0.61)
  Top 0.254: v30.48,40.64 29.21,39.37 29.21,38.1 v25.4,34.29 | v19.05,34.29 16.51,31.75 v16.51,7.62 | v58.42,6.35 v60.96,3.81 | v77.47,3.81 77.47,10.16 INDIKATORY.15
  Bottom 0.254: v30.48,40.64 33.02,43.18 R101.1 | v19.05,34.29 v25.4,34.29 | v16.51,7.62 17.78,6.35 v58.42,6.35 | v60.96,3.81 v77.47,3.81
J37  (via drill 0.61)
  Top 0.254: v29.21,83.82 24.13,78.74 24.13,25.4 26.67,22.86 v26.67,19.05 | v67.31,15.24 71.12,11.43 71.12,8.89 77.47,2.54 91.44,2.54 91.44,10.16 INDIKATORY.20
  Bottom 0.254: v29.21,83.82 38.1,83.82 39.37,85.09 R106.1 | v26.67,19.05 29.21,16.51 44.45,16.51 45.72,15.24 v67.31,15.24
J60  (via drill 0.61)
  Top 0.254: v62.23,35.56 62.23,22.86 72.39,12.7 v72.39,10.16
  Bottom 0.254: v62.23,35.56 58.42,39.37 52.07,39.37 46.99,44.45 R109.1 44.45,44.45 | v72.39,10.16 73.66,8.89 78.74,8.89 80.01,10.16 INDIKATORY.16
JB1  (via drill 0.61)
  Top 0.254: 59.69,64.77 59.69,55.88 58.42,54.61 T15.3 | 59.69,64.77 58.42,66.04 T12.3 | 59.69,64.77 59.69,72.39 58.42,72.39 T10.3 57.15,72.39 57.15,74.93 49.53,82.55 49.53,87.63 48.26,87.63 46.99,86.36 46.99,85.09 45.72,83.82 T37.3 | 16.51,35.56 19.05,38.1 T08.3 | R1.2 16.51,35.56 | 16.51,35.56 16.51,43.18 17.78,44.45 17.78,48.26 19.05,49.53 T07.3 | 21.59,71.12 21.59,62.23 20.32,60.96 T03.3 | 21.59,71.12 20.32,72.39 T02.3 | 21.59,71.12 21.59,82.55 20.32,83.82 T06.3 | 34.29,53.34 34.29,64.77 | 34.29,53.34 34.29,48.26 33.02,46.99 T36.3 31.75,46.99 31.75,48.26 v26.67,48.26 | 34.29,64.77 33.02,66.04 T34.3 | 34.29,53.34 33.02,53.34 T32.3 | 34.29,72.39 33.02,72.39 T30.3 | 34.29,64.77 34.29,72.39 | v36.83,81.28 34.29,78.74 34.29,72.39 | T14.3 83.82,66.04 85.09,64.77 85.09,34.29 83.82,33.02 T43.3 | DVERE.15 46.99,10.16 48.26,11.43 48.26,12.7 DVERE.2 | DVERE.17 41.91,10.16 41.91,12.7 DVERE.4 | DVERE.19 35.56,10.16 36.83,11.43 36.83,12.7 DVERE.6 | v78.74,25.4 78.74,15.24 76.2,12.7 INDIKATORY.2 | v10.16,21.59 10.16,16.51 13.97,12.7 13.97,7.62 16.51,5.08 29.21,5.08 29.21,6.35 v31.75,8.89
  Bottom 0.254: 19.05,26.67 16.51,29.21 8.89,29.21 7.62,30.48 7.62,34.29 R1.2 | T02.3 20.32,72.39 24.13,68.58 30.48,68.58 33.02,66.04 T34.3 | v26.67,48.26 21.59,48.26 20.32,49.53 T07.3 | v36.83,81.28 38.1,82.55 43.18,82.55 44.45,83.82 T37.3 | T43.3 83.82,33.02 85.09,33.02 85.09,30.48 83.82,29.21 83.82,26.67 T42.3 82.55,26.67 81.28,25.4 v78.74,25.4 | 39.37,11.43 38.1,12.7 DVERE.6 36.83,12.7 | 39.37,11.43 40.64,10.16 DVERE.17 | 39.37,11.43 45.72,11.43 46.99,10.16 DVERE.15 | 96.52,10.16 95.25,11.43 77.47,11.43 76.2,12.7 INDIKATORY.2 | 96.52,10.16 93.98,7.62 57.15,7.62 53.34,11.43 49.53,11.43 48.26,12.7 DVERE.2 | 96.52,10.16 INDIKATORY.22 | 19.05,26.67 13.97,21.59 v10.16,21.59 | v31.75,8.89 34.29,8.89 35.56,10.16 DVERE.19 | 19.05,26.67 T05.3
JB2  (via drill 0.61)
  Top 0.254: DVERE.23 24.13,10.16 25.4,11.43 25.4,12.7 DVERE.10 | DVERE.25 19.05,10.16 20.32,11.43 20.32,12.7 DVERE.12 | 31.75,12.7 31.75,11.43 30.48,10.16 DVERE.21 | 31.75,12.7 31.75,26.67 T41.3 33.02,26.67 34.29,27.94 34.29,33.02 33.02,33.02 T40.3 | 31.75,12.7 DVERE.8 | v45.72,40.64 45.72,46.99 T60.3 | 71.12,26.67 72.39,27.94 72.39,35.56 | 72.39,35.56 71.12,36.83 T56.3 | 72.39,43.18 71.12,43.18 T54.3 | 72.39,35.56 72.39,43.18 | v73.66,17.78 v71.12,20.32 71.12,26.67 | 71.12,26.67 T04.3 | T35.3 45.72,66.04 46.99,67.31 46.99,72.39 45.72,72.39 T31.3 | 72.39,63.5 71.12,64.77 71.12,66.04 T13.3 | 72.39,63.5 v73.66,62.23 | 72.39,55.88 71.12,54.61 T26.3 | 72.39,55.88 72.39,63.5 | 72.39,63.5 72.39,72.39 71.12,72.39 T11.3 | v86.36,48.26 v86.36,62.23 86.36,68.58 82.55,68.58 80.01,71.12 80.01,72.39 82.55,72.39 T16.3 | v50.8,63.5 54.61,59.69 55.88,60.96 v55.88,64.77 | 72.39,43.18 72.39,55.88
  Bottom 0.254: DVERE.23 24.13,10.16 21.59,12.7 DVERE.12 20.32,12.7 | T60.3 45.72,46.99 45.72,49.53 46.99,50.8 46.99,53.34 45.72,53.34 T33.3 | T41.3 33.02,26.67 34.29,26.67 35.56,25.4 43.18,25.4 44.45,26.67 T62.3 45.72,26.67 46.99,26.67 46.99,33.02 | 46.99,33.02 45.72,33.02 T61.3 | 46.99,33.02 43.18,36.83 41.91,36.83 41.91,38.1 43.18,39.37 44.45,39.37 v45.72,40.64 48.26,38.1 48.26,34.29 49.53,33.02 49.53,25.4 58.42,25.4 60.96,22.86 62.23,22.86 64.77,20.32 v71.12,20.32 | DVERE.10 26.67,12.7 29.21,10.16 DVERE.21 30.48,10.16 | T53.3 58.42,43.18 59.69,43.18 63.5,39.37 64.77,39.37 67.31,36.83 69.85,36.83 T56.3 | v73.66,17.78 78.74,12.7 INDIKATORY.3 | R18.2 88.9,62.23 v86.36,62.23 v73.66,62.23 | v86.36,48.26 85.09,48.26 83.82,46.99 T44.3 | v50.8,63.5 48.26,63.5 45.72,66.04 T35.3 | v55.88,64.77 59.69,64.77 63.5,68.58 68.58,68.58 71.12,66.04 T13.3
JB3  (via drill 0.61)
  Top 0.254: T01.3 58.42,26.67 59.69,27.94 59.69,35.56 58.42,36.83 T00.3 | R51.2 111.76,20.32 111.76,26.67 S48.3 | 114.3,43.18 114.3,36.83 113.03,35.56 S47.3 | 114.3,43.18 113.03,44.45 S46.3 | 114.3,52.07 113.03,53.34 S45.3 | 114.3,43.18 114.3,52.07 | 114.3,60.96 113.03,62.23 S44.3 | 114.3,52.07 114.3,60.96 | 114.3,69.85 113.03,71.12 S43.3 | 114.3,60.96 114.3,69.85 | 114.3,69.85 114.3,78.74 113.03,80.01 S42.3 | v82.55,25.4 82.55,12.7 INDIKATORY.4 | v87.63,54.61 88.9,55.88 91.44,55.88 93.98,53.34 99.06,53.34 S38.3 100.33,53.34 101.6,53.34 | 101.6,36.83 100.33,35.56 S40.3 | 101.6,36.83 101.6,43.18 | 101.6,43.18 100.33,44.45 S39.3 | 101.6,60.96 100.33,62.23 S37.3 | 101.6,43.18 101.6,53.34 | 101.6,53.34 101.6,60.96 | 101.6,69.85 100.33,71.12 S36.3 | 101.6,60.96 101.6,69.85 | 101.6,69.85 101.6,78.74 100.33,80.01 S35.3 | 101.6,36.83 101.6,27.94 100.33,26.67 S41.3
  Bottom 0.254: R51.2 106.68,21.59 64.77,21.59 62.23,24.13 60.96,24.13 58.42,26.67 T01.3 | 97.79,25.4 v82.55,25.4 | 97.79,25.4 99.06,26.67 S41.3 | v87.63,54.61 85.09,54.61 83.82,53.34 T47.3 | S47.3 111.76,35.56 110.49,34.29 101.6,34.29 100.33,35.56 S40.3 | 97.79,25.4 110.49,25.4 111.76,26.67 S48.3
N$1  (via drill 0.61)  (1 unrouted)
  Top 0.254: R83.2 69.85,31.75 T04.1 | R83.2 67.31,21.59 73.66,15.24 73.66,12.7 INDIKATORY.1 | R34.2 87.63,80.01 v87.63,59.69 | R83.2 67.31,36.83 68.58,38.1 68.58,40.64 67.31,41.91 67.31,48.26 v71.12,52.07 | v81.28,55.88 82.55,57.15 82.55,58.42 T47.1
  Bottom 0.254: R17.2 16.51,88.9 19.05,88.9 T06.1 | v87.63,59.69 86.36,58.42 83.82,58.42 T47.1 | v71.12,52.07 72.39,53.34 78.74,53.34 v81.28,55.88
N$7
  Bottom 0.254: 57.15,91.44 R8.1 | 57.15,91.44 R7.2 | 57.15,91.44 48.26,91.44 45.72,88.9 T37.1
N$9  (via drill 0.61)
  Top 0.254: v44.45,21.59 46.99,24.13 v46.99,62.23 | 73.66,74.93 R9.2 | v73.66,64.77 73.66,74.93 | 73.66,74.93 83.82,74.93 85.09,73.66 85.09,71.12 83.82,71.12 T14.1
  Bottom 0.254: R10.1 12.7,35.56 16.51,35.56 19.05,33.02 21.59,33.02 22.86,31.75 22.86,22.86 34.29,22.86 34.29,21.59 v44.45,21.59 | v46.99,62.23 68.58,62.23 68.58,64.77 v73.66,64.77
N$10
  Top 0.254: R10.2 20.32,43.18 T08.1
  Bottom 0.254: R11.1 17.78,45.72 R10.2
N$11
  Top 0.254: R12.1 13.97,54.61 R11.2
  Bottom 0.254: R11.2 17.78,55.88 19.05,54.61 T07.1
N$12  (via drill 0.61)
  Top 0.254: v83.82,19.05 83.82,24.13 85.09,25.4 85.09,30.48 83.82,31.75 T42.1 | v53.34,19.05 52.07,17.78 52.07,10.16 43.18,1.27 6.35,1.27 R13.1
  Bottom 0.254: R13.1 8.89,24.13 R12.2 | v53.34,19.05 v83.82,19.05
N$13  (via drill 0.61)
  Top 0.254: v83.82,43.18 83.82,38.1 T43.1 | v116.84,88.9 v116.84,43.18 | v39.37,90.17 v48.26,90.17 | v16.51,91.44 8.89,83.82 8.89,73.66 12.7,69.85 12.7,62.23 8.89,58.42 R14.1
  Bottom 0.254: R13.2 8.89,36.83 R14.1 | v116.84,43.18 v83.82,43.18 | v116.84,88.9 54.61,88.9 53.34,90.17 v48.26,90.17 | v39.37,90.17 36.83,90.17 36.83,91.44 v16.51,91.44
N$14
  Top 0.254: R14.2 10.16,33.02 R15.1
  Bottom 0.254: R14.2 10.16,33.02 17.78,33.02 19.05,31.75 T05.1
N$15
  Top 0.254: R15.2 10.16,58.42 13.97,62.23 R16.1
  Bottom 0.254: R16.1 19.05,66.04 T03.1
N$16
  Top 0.254: 13.97,77.47 R17.1 | R16.2 13.97,77.47 | 13.97,77.47 19.05,77.47 T02.1
N$20  (via drill 0.61)
  Top 0.254: v29.21,21.59 27.94,20.32 27.94,17.78 | 27.94,17.78 v27.94,13.97 | v46.99,13.97 v46.99,21.59 | v54.61,24.13 R20.2 | v60.96,77.47 v60.96,59.69 | v62.23,78.74 62.23,80.01 63.5,81.28 v63.5,87.63 | v46.99,87.63 45.72,86.36 v40.64,86.36 | v6.35,36.83 v6.35,74.93 | v26.67,17.78 27.94,17.78
  Bottom 0.254: v29.21,21.59 R21.1 | v27.94,13.97 v46.99,13.97 | v46.99,21.59 49.53,24.13 v54.61,24.13 | v60.96,59.69 60.96,50.8 58.42,48.26 T53.1 | v62.23,78.74 v60.96,77.47 | v63.5,87.63 53.34,87.63 52.07,86.36 49.53,86.36 48.26,87.63 v46.99,87.63 | v40.64,86.36 17.78,86.36 v6.35,74.93 | v6.35,36.83 5.08,35.56 5.08,21.59 7.62,21.59 11.43,17.78 v26.67,17.78
N$23  (via drill 0.61)
  Top 0.254: R23.2 10.16,74.93 12.7,74.93 12.7,80.01 19.05,86.36 30.48,86.36 30.48,78.74 29.21,77.47 29.21,64.77 31.75,62.23 31.75,60.96 v30.48,59.69 | v43.18,59.69 v39.37,59.69 | v43.18,45.72 43.18,39.37 44.45,38.1 T61.1
  Bottom 0.254: v39.37,59.69 v30.48,59.69 | v43.18,59.69 46.99,59.69 49.53,57.15 49.53,45.72 v43.18,45.72 | R24.1 45.72,25.4 46.99,25.4 48.26,26.67 48.26,33.02 45.72,35.56 45.72,38.1 T61.1
N$24  (via drill 0.61)
  Top 0.254: R24.2 v35.56,35.56 33.02,38.1 T40.1
  Bottom 0.254: v35.56,35.56 R25.1
N$25  (via drill 0.61)
  Top 0.254: v39.37,24.13 41.91,26.67 R25.2 41.91,29.21 44.45,31.75 T62.1
  Bottom 0.254: R26.1 v39.37,24.13
N$26
  Top 0.254: R26.2 31.75,31.75 T41.1
  Bottom 0.254: R27.1 41.91,39.37 36.83,39.37 34.29,36.83 34.29,31.75 33.02,31.75 T41.1
N$27
  Bottom 0.254: R27.2 55.88,45.72 67.31,45.72 | 67.31,45.72 69.85,48.26 T54.1 | R28.1 82.55,40.64 77.47,45.72 67.31,45.72
N$30  (via drill 0.61)
  Top 0.254: R30.2 R31.1 99.06,90.17 104.14,85.09 104.14,64.77 102.87,63.5 v102.87,52.07
  Bottom 0.254: v102.87,52.07 92.71,52.07 90.17,49.53 88.9,49.53 87.63,50.8 85.09,50.8 83.82,52.07 T44.1
N$31  (via drill 0.61)
  Top 0.254: R32.1 82.55,87.63 82.55,88.9 90.17,88.9 R31.2 92.71,80.01 v92.71,55.88
  Bottom 0.254: v92.71,55.88 82.55,55.88 81.28,57.15 73.66,57.15 71.12,59.69 T26.1
N$32
  Top 0.254: 83.82,86.36 R33.1 | 83.82,86.36 R32.2 | 83.82,86.36 83.82,77.47 T16.1
N$33  (via drill 0.61)
  Top 0.254: R34.1 R33.2 | v102.87,38.1 102.87,50.8 104.14,52.07 v104.14,57.15 | v97.79,60.96 93.98,64.77 v93.98,81.28
  Bottom 0.254: v102.87,38.1 99.06,38.1 97.79,39.37 73.66,39.37 71.12,41.91 T56.1 | v104.14,57.15 100.33,60.96 v97.79,60.96 | v93.98,81.28 82.55,81.28 81.28,82.55 R34.1
N$52
  Bottom 0.254: 54.61,76.2 L10.A 54.61,80.01 R105.2
N$53
  Bottom 0.254: R68.1 96.52,85.09 99.06,85.09 S35.1
N$54
  Top 0.254: R69.1 R68.2
  Bottom 0.254: R69.1 97.79,74.93 99.06,76.2 S36.1
N$55
  Top 0.254: R70.1 R69.2 99.06,67.31 S37.1
N$72
  Top 0.254: R70.2 R71.1 99.06,58.42 S38.1
N$73
  Bottom 0.254: R104.2 54.61,63.5 L12.A 54.61,67.31
N$74
  Bottom 0.254: 29.21,76.2 L30.A 29.21,80.01 R103.2
N$75
  Top 0.254: R72.1 96.52,49.53 | 96.52,49.53 R71.2 | 96.52,49.53 99.06,49.53 S39.1
N$76
  Top 0.254: R73.1 95.25,39.37 R72.2
  Bottom 0.254: R72.2 99.06,40.64 S40.1
N$77
  Top 0.254: R74.1 93.98,39.37 92.71,39.37 92.71,31.75 R73.2
  Bottom 0.254: R73.2 95.25,31.75 99.06,31.75 S41.1
N$78  (via drill 0.61)
  Top 0.254: v102.87,64.77 v102.87,85.09
  Bottom 0.254: R74.2 93.98,64.77 v102.87,64.77 | v102.87,85.09 104.14,86.36 R75.1 110.49,86.36 111.76,85.09 S42.1
N$79
  Top 0.254: R75.2 R76.1 111.76,76.2 S43.1
N$80
  Top 0.254: 109.22,67.31 R76.2 | R77.1 109.22,67.31 | 109.22,67.31 111.76,67.31 S44.1
N$81
  Top 0.254: R78.1 R77.2 111.76,58.42 S45.1
N$82
  Top 0.254: R79.1 R78.2
  Bottom 0.254: R78.2 110.49,48.26 111.76,49.53 S46.1
N$83
  Top 0.254: R79.2 111.76,40.64 S47.1
  Bottom 0.254: R80.1 116.84,40.64 113.03,40.64 S47.1
N$84
  Top 0.254: R80.2 109.22,29.21 111.76,31.75 S48.1
  Bottom 0.254: R81.1 R80.2
N$85
  Bottom 0.254: 55.88,31.75 R82.1 | 55.88,31.75 57.15,31.75 T01.1 | R81.2 64.77,22.86 55.88,31.75
N$86  (via drill 0.61)
  Top 0.254: v62.23,39.37 R83.1
  Bottom 0.254: v62.23,39.37 59.69,41.91 58.42,41.91 T00.1 57.15,41.91 55.88,41.91 R82.2
N$104
  Bottom 0.254: R102.2 29.21,63.5 L34.A 29.21,67.31
N$106
  Bottom 0.254: 29.21,57.15 L32.A 29.21,60.96 R100.2
N$107
  Bottom 0.254: R101.2 30.48,43.18 30.48,45.72 29.21,46.99 L36.A 29.21,48.26
N$108
  Bottom 0.254: R106.2 39.37,87.63 41.91,87.63 L37.A
N$109
  Bottom 0.254: 54.61,55.88 L15.A 54.61,52.07 R107.2 55.88,52.07
N$110
  Bottom 0.254: R108.2 80.01,63.5 L14.A 80.01,67.31
N$111
  Bottom 0.254: R109.2 41.91,44.45 L60.A 41.91,48.26
N$112
  Bottom 0.254: 41.91,57.15 L33.A 41.91,60.96 R110.2
N$113
  Bottom 0.254: R111.2 41.91,63.5 L35.A 41.91,67.31
N$114
  Bottom 0.254: 41.91,76.2 L31.A 41.91,80.01 R112.2
N$115
  Bottom 0.254: R113.2 67.31,63.5 L13.A 67.31,67.31
N$116
  Bottom 0.254: 67.31,76.2 L11.A 67.31,80.01 R114.2
N$117
  Bottom 0.254: 80.01,76.2 L16.A 80.01,80.01 R115.2
N$119  (via drill 0.61)
  Top 0.254: v48.26,57.15 v48.26,59.69 v48.26,68.58 v48.26,86.36 | R51.1 105.41,15.24 105.41,10.16 INDIKATORY.25 | v77.47,20.32 73.66,24.13 v73.66,60.96
  Bottom 0.254: 29.21,52.07 L32.C 29.21,54.61 | 29.21,52.07 L36.C 29.21,50.8 30.48,49.53 40.64,49.53 41.91,50.8 L60.C L33.C 41.91,54.61 43.18,54.61 44.45,55.88 46.99,55.88 v48.26,57.15 | R1.1 15.24,46.99 13.97,46.99 13.97,52.07 29.21,52.07 | v48.26,59.69 53.34,59.69 54.61,58.42 L15.C | v48.26,86.36 43.18,86.36 41.91,85.09 L37.C | 29.21,73.66 L30.C L34.C 29.21,69.85 30.48,69.85 31.75,68.58 40.64,68.58 | 41.91,73.66 L31.C L35.C 41.91,69.85 40.64,68.58 | 40.64,68.58 v48.26,68.58 53.34,68.58 54.61,69.85 L12.C L10.C 54.61,73.66 55.88,73.66 57.15,74.93 66.04,74.93 67.31,73.66 L11.C L13.C 67.31,69.85 68.58,69.85 69.85,68.58 74.93,68.58 | 80.01,73.66 L16.C L14.C 80.01,69.85 78.74,69.85 77.47,68.58 74.93,68.58 | R18.1 v73.66,60.96 72.39,62.23 72.39,63.5 73.66,63.5 74.93,64.77 74.93,68.58 | v77.47,20.32 R51.1